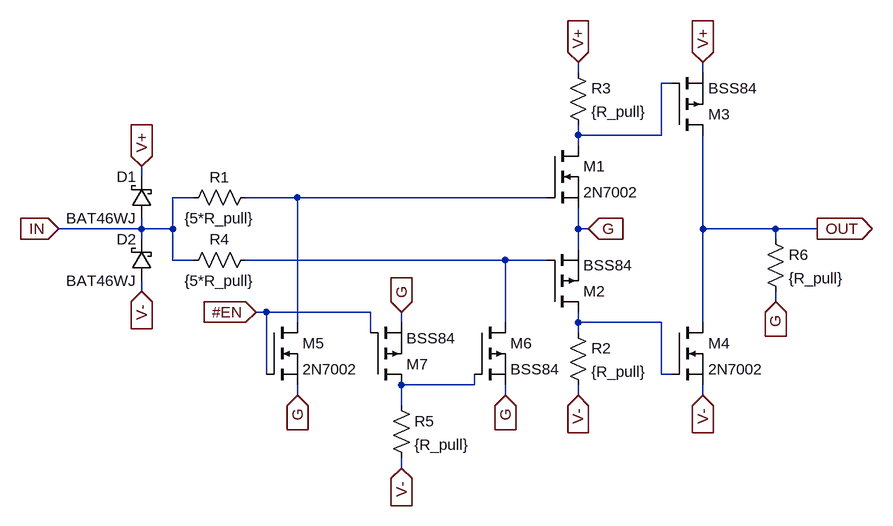
[diagram p0: schematic tri_buffer2.asc]
tri_buffer2.asc, the LTspice schematic file:
Version 4
SHEET 1 880 824
WIRE 48 -32 48 -48
WIRE 240 -32 240 -48
WIRE 192 -16 176 -16
WIRE 48 64 48 48
WIRE 176 64 176 -16
WIRE 176 64 48 64
WIRE 48 80 48 64
WIRE -624 128 -624 112
WIRE -544 160 -576 160
WIRE -384 160 -464 160
WIRE 0 160 -384 160
WIRE -624 208 -624 192
WIRE -624 208 -752 208
WIRE -576 208 -576 160
WIRE -576 208 -624 208
WIRE 48 208 48 176
WIRE 64 208 48 208
WIRE 240 208 240 64
WIRE 352 208 240 208
WIRE 416 208 352 208
WIRE -624 224 -624 208
WIRE 352 224 352 208
WIRE 48 240 48 208
WIRE -576 256 -576 208
WIRE -544 256 -576 256
WIRE -64 256 -464 256
WIRE 0 256 -64 256
WIRE -624 304 -624 288
WIRE 352 320 352 304
WIRE -432 336 -448 336
WIRE -272 336 -432 336
WIRE -384 352 -384 160
WIRE -224 352 -224 336
WIRE -64 352 -64 256
WIRE 48 352 48 336
WIRE 176 352 48 352
WIRE 240 352 240 208
WIRE -272 368 -272 336
WIRE 48 368 48 352
WIRE -432 432 -432 336
WIRE 176 432 176 352
WIRE 192 432 176 432
WIRE -112 448 -112 432
WIRE -112 448 -224 448
WIRE -384 464 -384 448
WIRE -64 464 -64 448
WIRE 48 464 48 448
WIRE 240 464 240 448
WIRE -224 480 -224 448
WIRE -224 576 -224 560
FLAG -624 112 V+
IOPIN -624 112 In
FLAG -624 304 V-
IOPIN -624 304 In
FLAG -384 464 G
IOPIN -384 464 In
FLAG -752 208 IN
IOPIN -752 208 In
FLAG 416 208 OUT
IOPIN 416 208 Out
FLAG -448 336 #EN
IOPIN -448 336 In
FLAG 48 -48 V+
IOPIN 48 -48 In
FLAG 240 -48 V+
IOPIN 240 -48 In
FLAG -224 576 V-
IOPIN -224 576 In
FLAG 48 464 V-
IOPIN 48 464 In
FLAG 240 464 V-
IOPIN 240 464 In
FLAG -224 336 G
IOPIN -224 336 In
FLAG -64 464 G
IOPIN -64 464 In
FLAG 64 208 G
IOPIN 64 208 In
FLAG 352 320 G
IOPIN 352 320 In
SYMBOL nmos 0 80 R0
SYMATTR InstName M1
SYMATTR Value 2N7002
SYMBOL pmos 0 336 M180
SYMATTR InstName M2
SYMATTR Value BSS84
SYMBOL schottky -608 192 R180
WINDOW 0 24 64 Left 2
WINDOW 3 24 0 Left 2
SYMATTR InstName D1
SYMATTR Value BAT46WJ
SYMATTR Description Diode
SYMATTR Type diode
SYMBOL schottky -608 288 R180
WINDOW 0 24 64 Left 2
WINDOW 3 24 0 Left 2
SYMATTR InstName D2
SYMATTR Value BAT46WJ
SYMATTR Description Diode
SYMATTR Type diode
SYMBOL res 32 352 R0
SYMATTR InstName R2
SYMATTR Value {R_pull}
SYMBOL res 32 -48 R0
SYMATTR InstName R3
SYMATTR Value {R_pull}
SYMBOL pmos 192 64 M180
SYMATTR InstName M3
SYMATTR Value BSS84
SYMBOL nmos 192 352 R0
SYMATTR InstName M4
SYMATTR Value 2N7002
SYMBOL res -448 144 R90
WINDOW 0 0 56 VBottom 2
WINDOW 3 32 56 VTop 2
SYMATTR InstName R1
SYMATTR Value {5*R_pull}
SYMBOL res -448 240 R90
WINDOW 0 0 56 VBottom 2
WINDOW 3 32 56 VTop 2
SYMATTR InstName R4
SYMATTR Value {5*R_pull}
SYMBOL nmos -432 352 R0
SYMATTR InstName M5
SYMATTR Value 2N7002
SYMBOL pmos -112 352 R0
SYMATTR InstName M6
SYMATTR Value BSS84
SYMBOL res -240 464 R0
SYMATTR InstName R5
SYMATTR Value {R_pull}
SYMBOL pmos -272 448 M180
SYMATTR InstName M7
SYMATTR Value BSS84
SYMBOL res 336 208 R0
SYMATTR InstName R6
SYMATTR Value {R_pull}

The netlist it stands for:
* tri_buffer2.asc
M1 N001 N002 G G 2N7002
M2 N004 N003 G G BSS84
D1 IN V+ BAT46WJ
D2 V- IN BAT46WJ
R2 N004 V- {R_pull}
R3 V+ N001 {R_pull}
M3 OUT N001 V+ V+ BSS84
M4 OUT N004 V- V- 2N7002
R1 N002 IN {5*R_pull}
R4 N003 IN {5*R_pull}
M5 N002 #EN G G 2N7002
M6 N003 N005 G G BSS84
R5 N005 V- {R_pull}
M7 N005 #EN G G BSS84
R6 OUT G {R_pull}
.model D D
.lib standard.dio
.model NMOS NMOS
.model PMOS PMOS
.lib standard.mos
.backanno
.end